# EAGLE design bot_base (EAGLE 7.7.0)
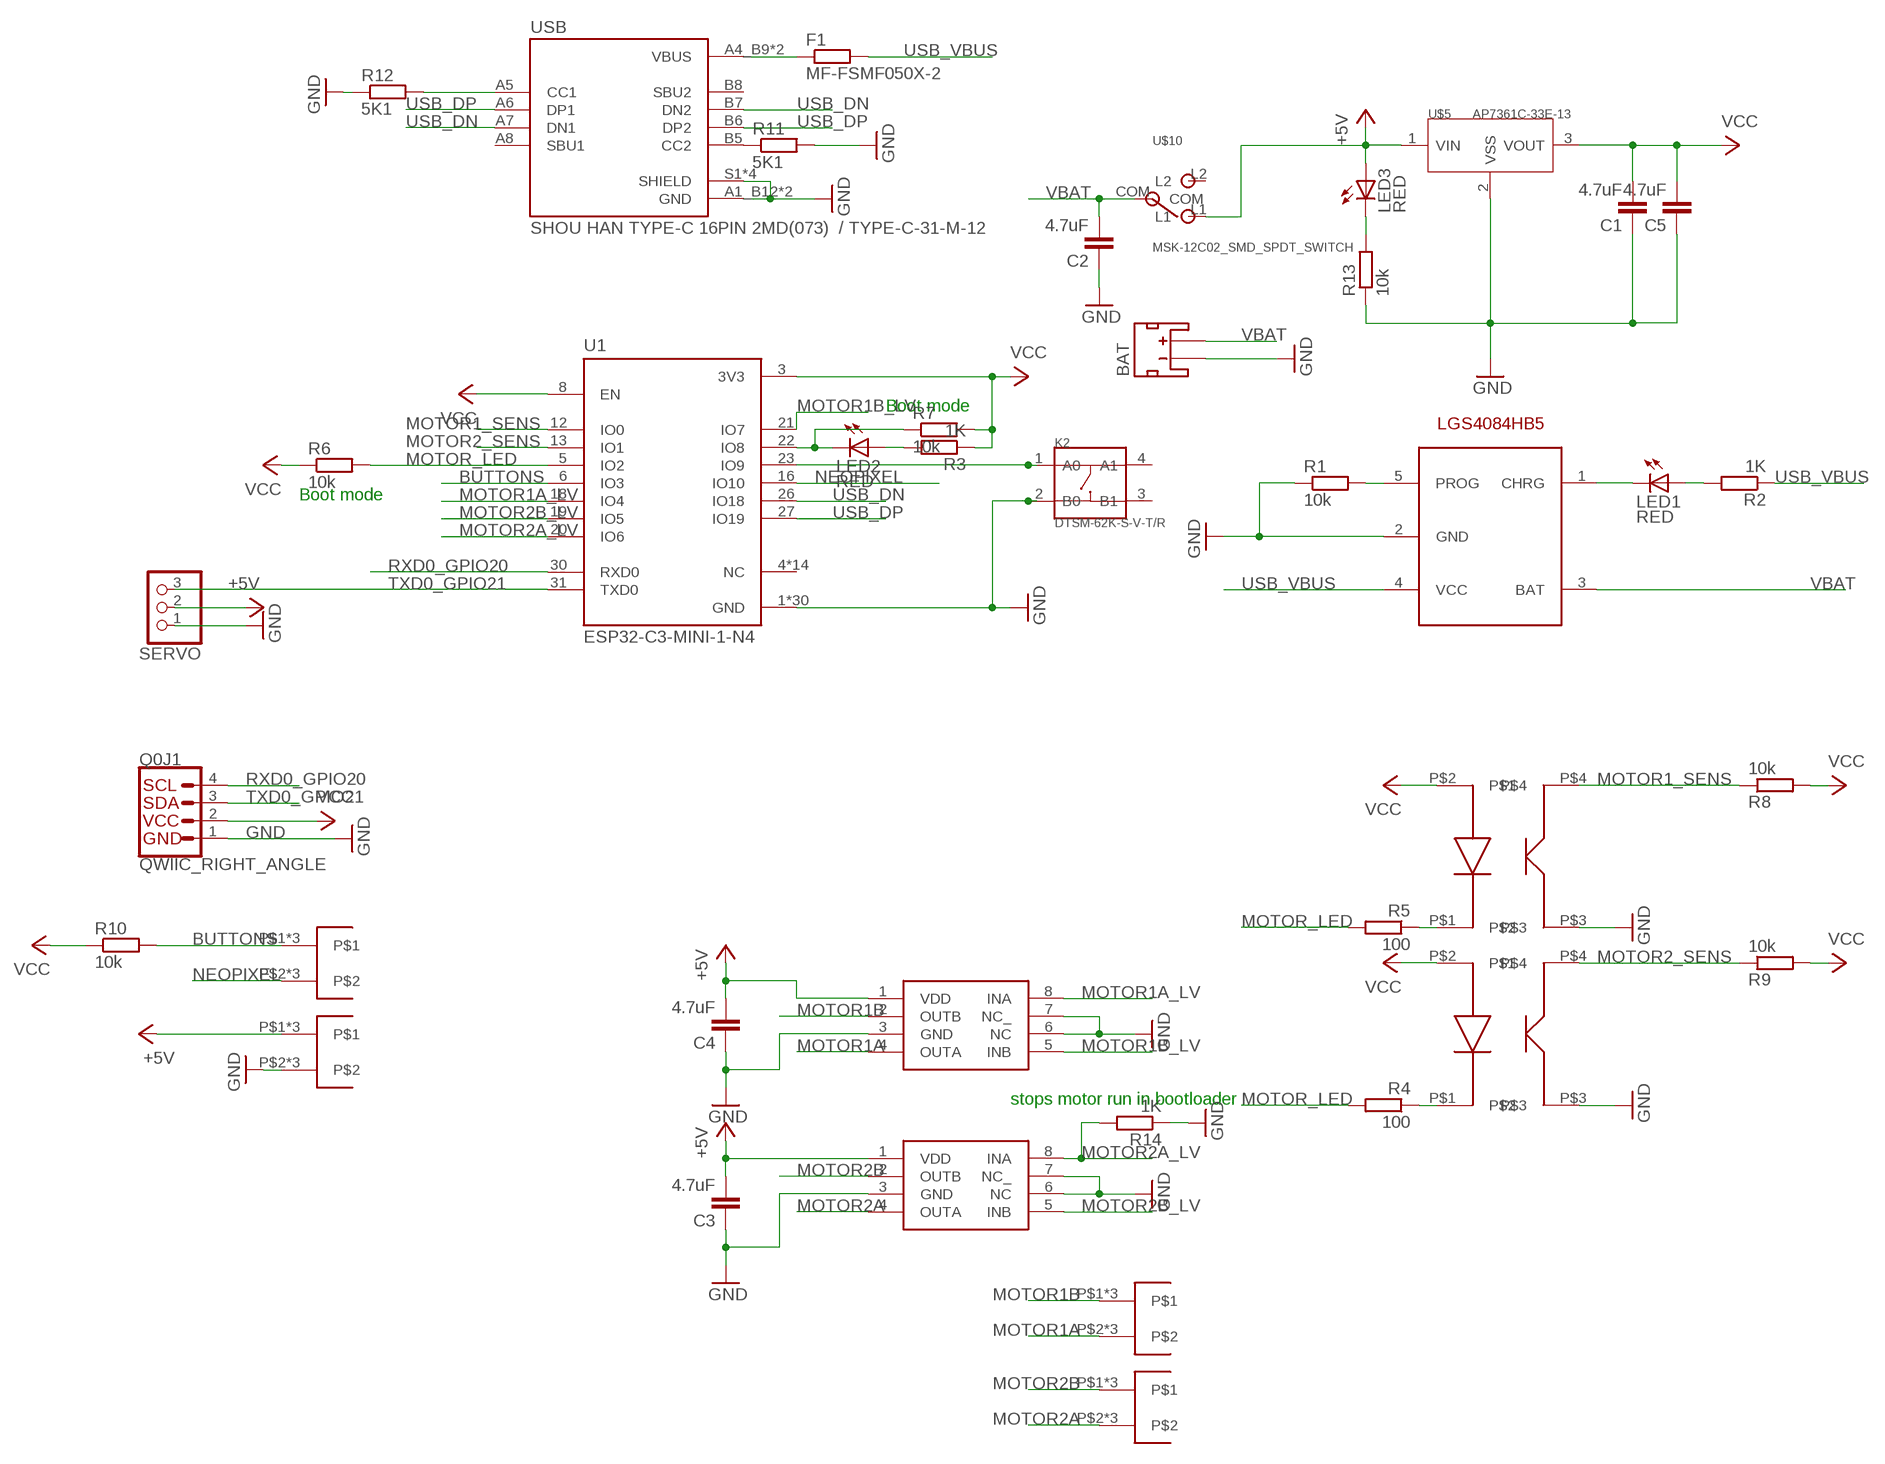
[diagram p0: schematic, sheet 1]

## Parts
BAT  C47647 / S2B-PH-SM4-TB  JST_2MM_MALE  [JST-2-SMD]
C1  4.7uF  C-EUC0805  [C0805]
C2  4.7uF  C-EUC0805  [C0805]
C3  4.7uF  C-EUC0805  [C0805]
C4  4.7uF  C-EUC0805  [C0805]
C5  4.7uF  C-EUC0805  [C0805]
F1  MF-FSMF050X-2  R-EU_R0603  [R0603]
K2  DTSM-62K-S-V-T/R  SMD-SWITCH-TACTILE-SPST-NO(4P-D6.0MM)  [SW4-SMD-6.0X6.0X5.0MM]
LED1  RED  LEDCHIPLED_0603  [CHIPLED_0603]
LED2  RED  LEDCHIPLED_0603  [CHIPLED_0603]
LED3  RED  LEDCHIPLED_0603  [CHIPLED_0603]
Q0  QWIIC_RIGHT_ANGLE  QWIIC_CONNECTORJS-1MM  [JST04_1MM_RA]
R1  10k  R-EU_R0603  [R0603]
R2  1K  R-EU_R0603  [R0603]
R3  1K  R-EU_R0603  [R0603]
R4  100  R-EU_R0603  [R0603]
R5  100  R-EU_R0603  [R0603]
R6  10k  R-EU_R0603  [R0603]
R7  10k  R-EU_R0603  [R0603]
R8  10k  R-EU_R0603  [R0603]
R9  10k  R-EU_R0603  [R0603]
R10  10k  R-EU_R0603  [R0603]
R11  5K1  R-EU_R0603  [R0603]
R12  5K1  R-EU_R0603  [R0603]
R13  10k  R-EU_R0603  [R0603]
R14  1K  R-EU_R0603  [R0603]
SERVO  PINHD-1X03_2.54-S  [1X03-S]
U1  ESP32-C3-MINI-1-N4  [XCVR_ESP32-C3-MINI-1-N4]
U4  LGS4084HB5  [SOT23-5]
U$1  XL-ITR9707  [XL-ITR9707]
U$2  XL-ITR9707  [XL-ITR9707]
U$3  GR6205  [SOP8]
U$4  GR6205  [SOP8]
U$5  AP7361C-33E-13  [SOT223]
U$6  PCBSIDE2  [PCBSIDE2]
U$7  PCBSIDE2  [PCBSIDE2]
U$8  PCBSIDE2  [PCBSIDE2]
U$9  PCBSIDE2  [PCBSIDE2]
U$10  MSK-12C02_SMD_SPDT_SWITCH  [MSK-12C02]
USB  SHOU HAN TYPE-C 16PIN 2MD(073) / TYPE-C-31-M-12  TYPE-C-31-M-12  [HRO_TYPE-C-31-M-12]

## Nets
+5V: C3.2 C4.2 LED3.A SERVO.2 U$3.1(VDD) U$4.1(VDD) U$5.1(VIN) U$9.P$1 U$9.P$3 U$9.P$4 U$10.L1
BOOT: K2.1(A0) U1.23(IO9)
BUTTONS: R10.2 U1.6(IO3) U$8.P$1 U$8.P$3 U$8.P$4
GND: BAT.1(-) C1.1 C2.1 C3.1 C4.1 C5.1 K2.2(B0) Q0.1 R1.1 R11.2 R12.1 R13.1 R14.1 SERVO.1 U1.1(GND) U1.2(GND) U1.11(GND) U1.14(GND) U1.36(GND) U1.37(GND) U1.38(GND) U1.39(GND) U1.40(GND) U1.41(GND) U1.42(GND) U1.43(GND) U1.44(GND) U1.45(GND) U1.46(GND) U1.47(GND) U1.48(GND) U1.49_1(GND) U1.49_2(GND) U1.49_3(GND) U1.49_4(GND) U1.49_5(GND) U1.49_6(GND) U1.49_7(GND) U1.49_8(GND) U1.49_9(GND) U1.50(GND) U1.51(GND) U1.52(GND) U1.53(GND) U4.2(GND) U$1.P$3 U$2.P$3 U$3.3(GND) U$3.6(NC) U$3.7(NC_) U$4.3(GND) U$4.6(NC) U$4.7(NC_) U$5.2(VSS) U$9.P$2 U$9.P$5 U$9.P$6 USB.A1_B12(GND) USB.B1_A12(GND) USB.S1(SHIELD) USB.S2(SHIELD) USB.S3(SHIELD) USB.S4(SHIELD)
MOTOR1_SENS: R8.1 U1.12(IO0) U$1.P$4
MOTOR1A: U$3.4(OUTA) U$6.P$2 U$6.P$5 U$6.P$6
MOTOR1A_LV: U1.18(IO4) U$3.8(INA)
MOTOR1B: U$3.2(OUTB) U$6.P$1 U$6.P$3 U$6.P$4
MOTOR1B_LV: U1.21(IO7) U$3.5(INB)
MOTOR2_SENS: R9.1 U1.13(IO1) U$2.P$4
MOTOR2A: U$4.4(OUTA) U$7.P$2 U$7.P$5 U$7.P$6
MOTOR2A_LV: R14.2 U1.20(IO6) U$4.8(INA)
MOTOR2B: U$4.2(OUTB) U$7.P$1 U$7.P$3 U$7.P$4
MOTOR2B_LV: U1.19(IO5) U$4.5(INB)
MOTOR_LED: R4.2 R5.2 R6.2 U1.5(IO2)
N$1: LED1.C U4.1(CHRG)
N$2: LED3.C R13.2
N$3: R5.1 U$1.P$1
N$4: LED1.A R2.2
N$5: R4.1 U$2.P$1
N$8: LED2.A R3.2
N$9: R11.1 USB.B5(CC2)
N$10: LED2.C R7.1 U1.22(IO8)
N$14: R12.2 USB.A5(CC1)
N$18: R1.2 U4.5(PROG)
NEOPIXEL: U1.16(IO10) U$8.P$2 U$8.P$5 U$8.P$6
RXD0_GPIO20: Q0.4 U1.30(RXD0)
TXD0_GPIO21: Q0.3 SERVO.3 U1.31(TXD0)
USB_DN: U1.26(IO18) USB.A7(DN1) USB.B7(DN2)
USB_DP: U1.27(IO19) USB.A6(DP1) USB.B6(DP2)
USB_VBUS: F1.2 R2.1 U4.4(VCC)
VBAT: BAT.2(+) C2.2 U4.3(BAT) U$10.COM
VBUS1: F1.1 USB.A4_B9(VBUS) USB.B4_A9(VBUS)
VCC: C1.2 C5.2 Q0.2 R3.1 R6.1 R7.2 R8.2 R9.2 R10.1 U1.3(3V3) U1.8(EN) U$1.P$2 U$2.P$2 U$5.3(VOUT)
Unconnected: BAT.NC1(PAD1) BAT.NC2(PAD2) K2.3(B1) K2.4(A1) Q0.NC1 Q0.NC2 U1.4(NC) U1.7(NC) U1.9(NC) U1.10(NC) U1.15(NC) U1.17(NC) U1.24(NC) U1.25(NC) U1.28(NC) U1.29(NC) U1.32(NC) U1.33(NC) U1.34(NC) U1.35(NC) U$10.L2 USB.A8(SBU1) USB.B8(SBU2)

## Notes on the sheet
- Boot mode
- LGS4084HB5
- Boot mode
- stops motor run in bootloader

## Library data of the parts
BAT = SparkFun-Connectors:JST_2MM_MALE: Mates to single-cell LiPo batteries. CONN-11443 Now with smashable polarity marks!; BTM_NEG: -; BTM_POS: +; PROD_ID: CONN-11443; TOP_NEG: -; TOP_POS: +
C1-C5 = rcl:C-EU: CAPACITOR, European symbol
F1 R1-R14 = rcl:R-EU_: RESISTOR, European symbol
K2 = Seeed-OPL-Button:SMD-SWITCH-TACTILE-SPST-NO(4P-D6.0MM): 311020004; MPN: DTSM-62K-S-V-T/R
LED1-LED3 = led:LED: LED OSRAM: - CHIPLED LG R971, LG N971, LY N971, LG Q971, LY Q971, LO R971, LY R971 LH N974, LH R974 LS Q976, LO Q976, LY Q976 LO Q996 - Hyper CHIPLED LW Q18S LB Q993, LB Q99A, LB R99A - SideLED LS A670, LO A670, LY A670, LG A670, LP A670 LB A673, LV A673, LT A673, LW A673 LH A674 LY A675 LS A676, LA A676, LO A676, LY A676, LW A676 LS A679, LY A679, LG A679 - Hyper Micro SIDELED® LS Y876, LA Y876, LO Y876, LY Y876 LT Y87S - SmartLED LW L88C, LW L88S LB L89C, LB L89S, LG L890 LS L89K, LO L89K, LY L89K LS L896, LA L896, LO L896, LY L896 - TOPLED LS T670, LO T670, LY T670, LG T670, LP T670 LSG T670, LSP T670, LSY T670, LOP T670, LYG T670 LG T671, LOG T671, LSG T671 LB T673, LV T673, LT T673, LW T673 LH T674 LS T676, LA T676, LO T676, LY T676, LB T676, LH T676, LSB T676, LW T676 LB T67C, LV T67C, LT T67C, LS T67K, LO T67K, LY T67K, LW E67C LS E67B, LA E67B, LO E67B, LY E67B, LB E67C, LV E67C, LT E67C LW T67C LS T679, LY T679, LG T679 LS T770, LO T770, LY T770, LG T770, LP T770 LB T773, LV T773, LT T773, LW T773 LH T774 LS E675, LA E675, LY E675, LS T675 LS T776, LA T776, LO T776, LY T776, LB T776 LHGB T686 LT T68C, LB T68C - Hyper Mini TOPLED® LB M676 - Mini TOPLED Santana® LG M470 LS M47K, LO M47K, LY M47K Source: http://www.osram.convergy.de LUXEON: - LUMILED® LXK2-PW12-R00, LXK2-PW12-S00, LXK2-PW14-U00, LXK2-PW14-V00 LXK2-PM12-R00, LXK2-PM12-S00, LXK2-PM14-U00 LXK2-PE12-Q00, LXK2-PE12-R00, LXK2-PE12-S00, LXK2-PE14-T00, LXK2-PE14-U00 LXK2-PB12-K00, LXK2-PB12-L00, LXK2-PB12-M00, LXK2-PB14-N00, LXK2-PB14-P00, LXK2-PB14-Q00 LXK2-PR12-L00, LXK2-PR12-M00, LXK2-PR14-Q00, LXK2-PR14-R00 LXK2-PD12-Q00, LXK2-PD12-R00, LXK2-PD12-S00 LXK2-PH12-R00, LXK2-PH12-S00 LXK2-PL12-P00, LXK2-PL12-Q00, LXK2-PL12-R00 Source: www.luxeon.com KINGBRIGHT: KA-3528ASYC Source: www.kingbright.com
Q0 = SparkFun-Connectors:QWIIC_CONNECTOR: SparkFun I2C Standard Qwiic Connector An SMD 1mm pitch JST connector makes it easy and quick (get it? Qwiic?) to connect I2C devices to each other. The Qwiic system <http://www.sparkfun.com/qwiic> enables fast and solderless connection between popular platforms and various sensors and actuators. We carry 200mm <https://www.sparkfun.com/products/14204>, 100mm <https://www.sparkfun.com/products/14205>, 50mm <https://www.sparkfun.com/products/14206>, and breadboard friendly <https://www.sparkfun.com/products/14207> Qwiic cables. We also offer 10 pcs strips <https://www.sparkfun.com/products/14323> the SMD connectors.; PROD_ID: CONN-13694
SERVO = pinhead-2:PINHD-1X03: PIN HEADER
U1 = ESP32-C3-MINI-1-N4:ESP32-C3-MINI-1-N4: Check availability; AVAILABILITY: In Stock; CHECK_PRICES: https://www.snapeda.com/parts/ESP32-C3-MINI-1-N4/Espressif+Systems/view-part/?ref=eda; DESCRIPTION: Bluetooth, WiFi 802.11b/g/n, Bluetooth v5.0 Transceiver Module 2.412GHz ~ 2.484GHz PCB Trace Surface Mount; MF: Espressif Systems; MP: ESP32-C3-MINI-1-N4; PACKAGE: SMD-53 Espressif Systems; PRICE: None; PURCHASE-URL: https://www.snapeda.com/api/url_track_click_mouser/?unipart_id=5656579&manufacturer=Espressif Systems&part_name=ESP32-C3-MINI-1-N4&search_term=None; SNAPEDA_LINK: https://www.snapeda.com/parts/ESP32-C3-MINI-1-N4/Espressif+Systems/view-part/?ref=snap
U4 = lipo_chargers:LGS4084HB5
U$1 U$2 = ir-XINGLIGHT-XL-ITR9608:XL-ITR9707
U$3 U$4 = motordriver-GR6205:GR6205
U$5 = vreg:AP7361C-33E-13
U$6-U$9 = testpoint:PCBSIDE2
U$10 = switch-MSK-12C02:MSK-12C02_SMD_SPDT_SWITCH: Footprint of the VIMEX MSK-12C02 SPDT SMD Switch Created by mzst on 17-Jan-2016
USB = USB-TYPE-C-31-M-12:TYPE-C-31-M-12: Check availability; AVAILABILITY: Not in stock; CHECK_PRICES: https://www.snapeda.com/parts/TYPE-C-31-M-12/HRO+Electronics+Co.%252C+Ltd./view-part/?ref=eda; DESCRIPTION: USB Connectors 24 Receptacle 1 8.94*7.3mm RoHS; MF: HRO Electronics Co., Ltd.; MP: TYPE-C-31-M-12; PACKAGE: Package; PRICE: None; SNAPEDA_LINK: https://www.snapeda.com/parts/TYPE-C-31-M-12/HRO+Electronics+Co.%252C+Ltd./view-part/?ref=snap

## Board
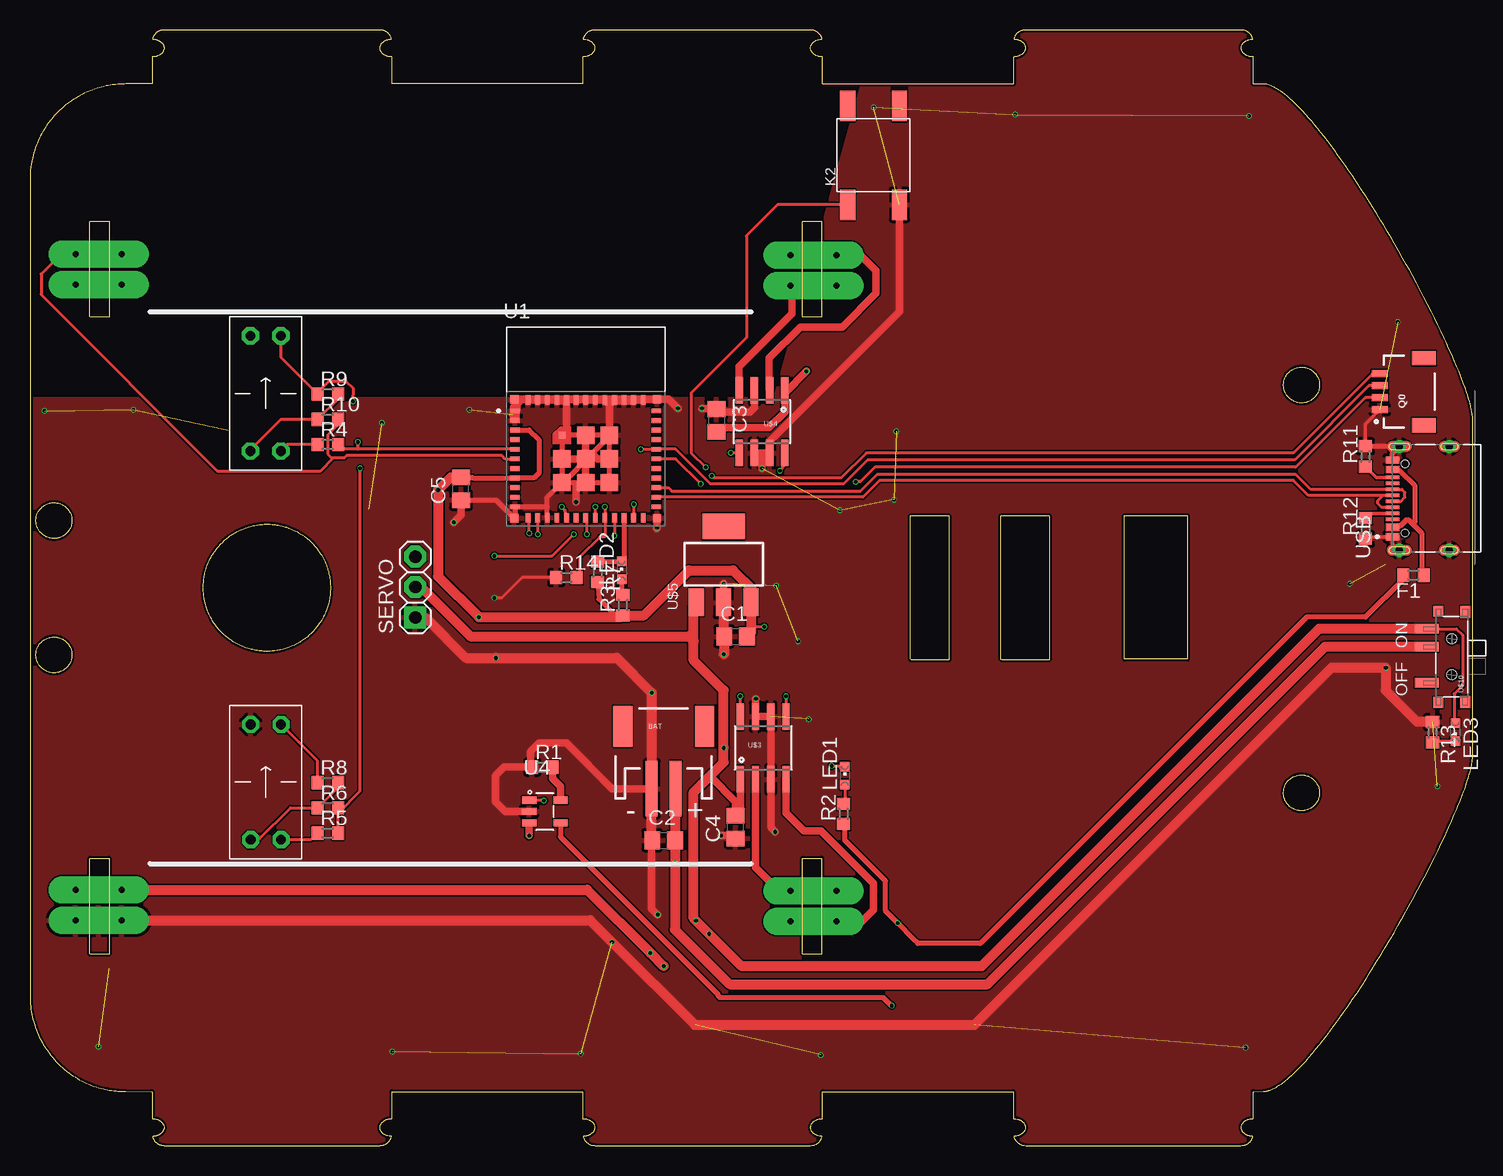
[diagram p1: board, top side]
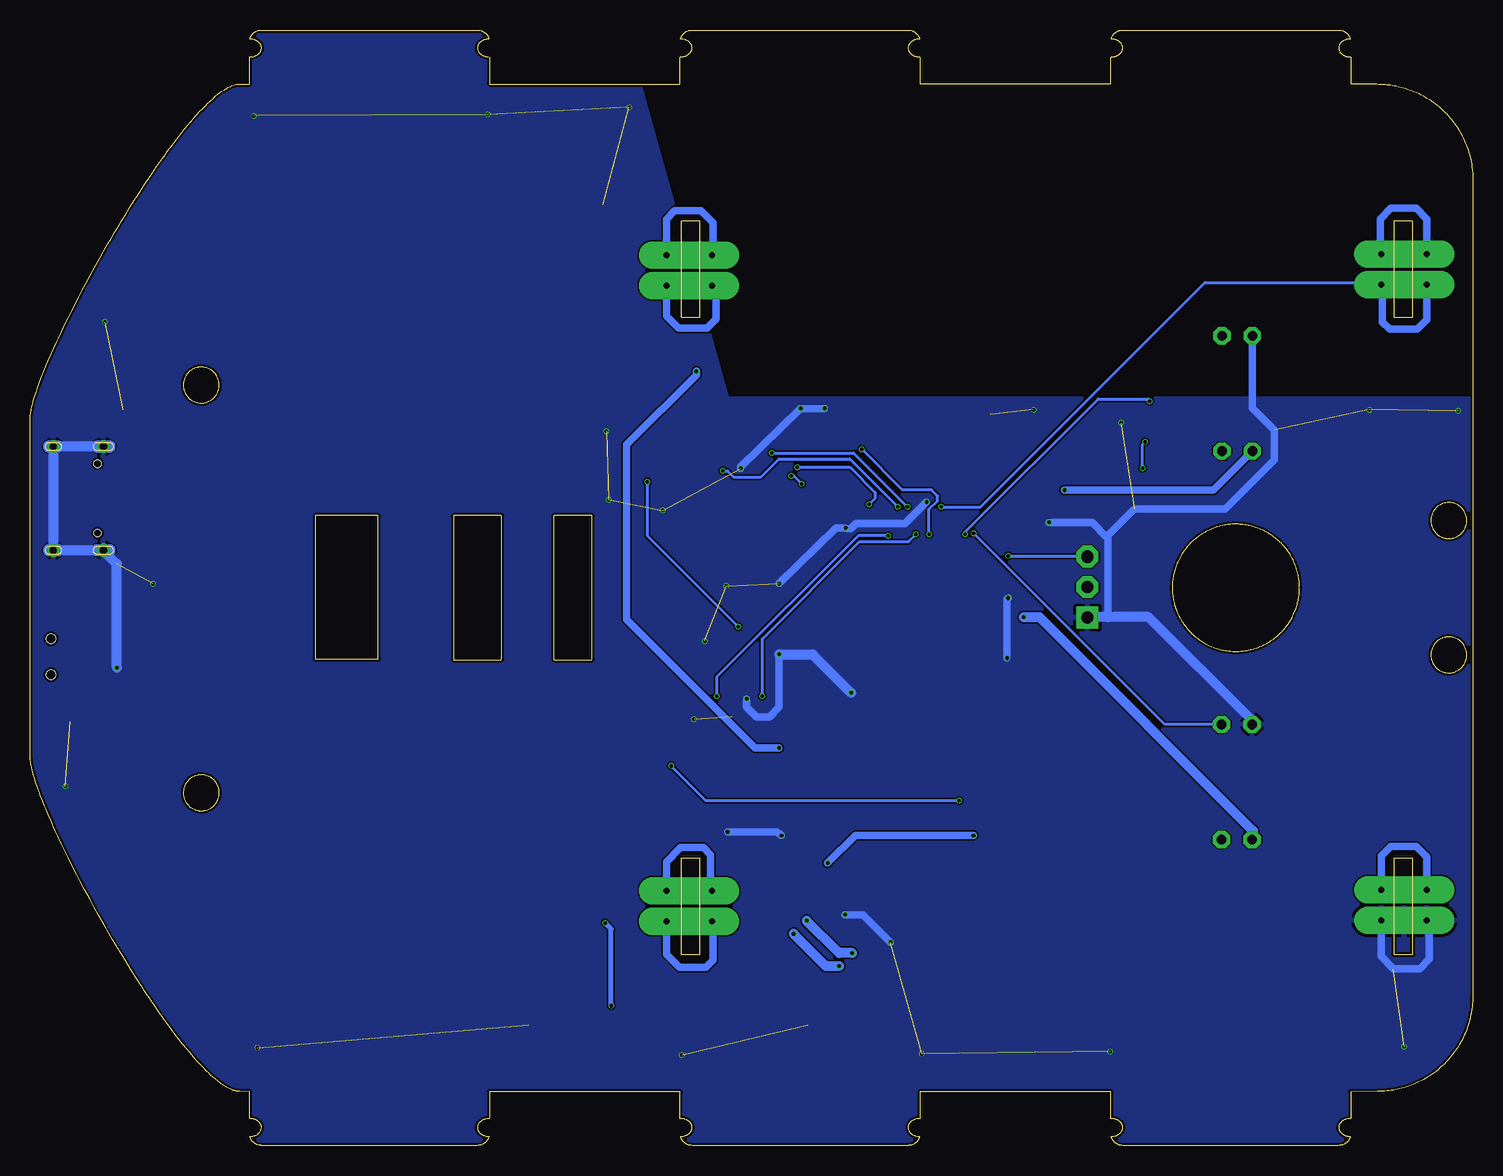
[diagram p2: board, bottom side, seen from below]

Size 120.27 x 93 mm. Coordinates in mm from the lower left corner, seen from the top.
Outline: 1944 segments
Copper layers (1*16): Top 0.035mm / dielectric 1.6mm / Bottom 0.035mm
Design rules "jlcpcb-2layers *": minimum track width 5mil, minimum drill 0.3mm, track to track 5mil, track to pad 5mil, pad to pad 5mil, via to via 5mil, smd to smd 5mil, copper to edge 0.2mm, drill to drill 6mil, minimum pad ring 10mil, minimum via ring 3mil, stop-mask expansion 4mil, vias tented up to drill 25mil, thermal gap 10mil
tKeepout: area 6.6,4.4 to 64.3,23.4; area 6.6,69.5 to 64.3,88.5; area 73.4,4.9 to 106.1,88.5

### Footprints (pad centres in the part's own frame; a part is rotated, then mirrored left to right if it is on the bottom)
JST-2-SMD = smd 1 x 4.6: 1 -1,-3.7; 2 1,-3.7 | smd 1.6 x 3.4: NC1 -3.4,1.5; NC2 3.4,1.5
C0805 = smd 1.3 x 1.5: 1 -0.95,0; 2 0.95,0
R0603 = smd 1 x 1.1: 1 -0.85,0; 2 0.85,0
SW4-SMD-6.0X6.0X5.0MM = smd 2.54 x 1.27: 1 -4.129,2.159; 2 -4.129,-2.159; 3 4.129,-2.159; 4 4.129,2.159
CHIPLED_0603 = smd 0.8 x 0.8: A 0,-0.75; C 0,0.75
JST04_1MM_RA = smd 0.6 x 1.35: 1 -1.5,0; 2 -0.5,0; 3 0.5,0; 4 1.5,0 | smd 1.2 x 2: NC1 2.8,-3.675; NC2 -2.8,-3.675
1X03-S = drill 1.016 square: 1 -2.54,0 | drill 1.016 octagon: 2 0,0; 3 2.54,0
XCVR_ESP32-C3-MINI-1-N4 = smd 0.8 x 0.4: 1 -5.9,1.3; 2 -5.9,0.5; 3 -5.9,-0.3; 4 -5.9,-1.1; 5 -5.9,-1.9; 6 -5.9,-2.7; 7 -5.9,-3.5; 8 -5.9,-4.3; 9 -5.9,-5.1; 10 -5.9,-5.9; 11 -5.9,-6.7; 25 5.9,-6.7; 26 5.9,-5.9; 27 5.9,-5.1; 28 5.9,-4.3; 29 5.9,-3.5; 30 5.9,-2.7; 31 5.9,-1.9; 32 5.9,-1.1; 33 5.9,-0.3; 34 5.9,0.5; 35 5.9,1.3 | smd 0.4 x 0.8: 12 -4.8,-7.6; 13 -4,-7.6; 14 -3.2,-7.6; 15 -2.4,-7.6; 16 -1.6,-7.6; 17 -0.8,-7.6; 18 0,-7.6; 19 0.8,-7.6; 20 1.6,-7.6; 21 2.4,-7.6; 22 3.2,-7.6; 23 4,-7.6; 24 4.8,-7.6; 36 4.8,2.2; 37 4,2.2; 38 3.2,2.2; 39 2.4,2.2; 40 1.6,2.2; 41 0.8,2.2; 42 0,2.2; 43 -0.8,2.2; 44 -1.6,2.2; 45 -2.4,2.2; 46 -3.2,2.2; 47 -4,2.2; 48 -4.8,2.2 | smd 0.6 x 0.6: 49_1 -1.975,-0.725 | smd 1.45 x 1.45: 49_2 0,-0.725; 49_3 1.975,-0.725; 49_4 1.975,-2.7; 49_5 1.975,-4.675; 49_6 0,-4.675; 49_7 -1.975,-4.675; 49_8 -1.975,-2.7; 49_9 0,-2.7 | smd 0.7 x 0.7: 50 5.95,2.25; 51 5.95,-7.65; 52 -5.95,-7.65; 53 -5.95,2.25
SOT23-5 = smd 1.2 x 0.6: 1 -1.306,0.95; 2 -1.306,0; 3 -1.306,-0.95; 4 1.306,-0.95; 5 1.306,0.95
XL-ITR9707 = drill 0.8 octagon: P$1 -4.8,-1.27; P$2 -4.8,1.27; P$3 4.8,1.27; P$4 4.8,-1.27
SOP8 = smd 0.61 x 2.21: 1 -1.905,-2.616; 2 -0.635,-2.616; 3 0.635,-2.616; 4 1.905,-2.616; 5 1.905,2.616; 6 0.635,2.616; 7 -0.635,2.616; 8 -1.905,2.616
SOT223 = smd 1.27 x 2.286: 1 -2.286,-3.175; 2 0,-3.175; 3 2.286,-3.175 | smd 3.556 x 2.159: TER 0,3.175
PCBSIDE2 = drill 0 pad 2.286 long: P$1 0,1.27; P$2 0,-1.27 | drill 0.5 pad 2.286 long: P$3 -1.905,1.27; P$4 1.905,1.27; P$5 -1.905,-1.27; P$6 1.905,-1.27
MSK-12C02 = smd 0.8 x 2: COM 0.823,2.1; L1 2.323,2.1; L2 -2.177,2.1 | smd 1 x 0.8: GND@1 -3.75,-1.125; GND@4 3.75,-1.125 | smd 0.9 x 0.8: GND@2 -3.8,1.125; GND@3 3.8,1.125 | hole 0.8: -1.5,0; 1.5,0
HRO_TYPE-C-31-M-12 = smd 0.6 x 1.14: A1_B12 -3.2,4.75; A4_B9 -2.4,4.75; B1_A12 3.2,4.75; B4_A9 2.4,4.75 | smd 0.3 x 1.14: A5 -1.25,4.75; A6 -0.25,4.75; A7 0.25,4.75; A8 1.25,4.75; B5 1.75,4.75; B6 0.75,4.75; B7 -0.75,4.75; B8 -1.75,4.75 | drill 0.6 pad 0.9: S1 -4.325,4.17; S2 4.325,4.17; S3 -4.325,0; S4 4.325,0 | hole 0.6: -2.89,3.68; 2.89,3.68

### Placement (x,y rotation side)
BAT  52.82,33.45 0 top
C1  58.82,42.45 0 top
C2  52.82,25.45 0 top
C3  57.22,60.45 270 top
C4  58.82,26.55 90 top
C5  35.92,54.75 90 top
F1  115.32,47.55 180 top
K2  70.32,82.55 90 top
LED1  67.92,30.85 0 top
LED2  49.32,47.95 0 top
LED3  118.82,34.45 180 top
Q0  112.52,62.85 90 top
R1  42.72,31.55 0 top
R2  67.82,27.65 90 top
R3  49.42,45.05 90 top
R4  24.82,58.45 0 top
R5  24.82,26.05 0 top
R6  24.82,28.15 0 top
R7  47.32,47.85 270 top
R8  24.82,30.25 0 top
R9  24.82,62.65 0 top
R10  24.82,60.55 0 top
R11  111.32,57.45 90 top
R12  111.32,51.45 90 top
R13  116.92,34.45 270 top
R14  44.72,47.35 0 top
SERVO  32.12,46.55 90 top
U1  46.32,59.95 0 top
U4  42.92,27.85 0 top
U$1  19.66,30.31 90 top
U$2  19.64,62.7 90 top
U$3  61.12,33.15 0 top
U$4  61.02,60.35 180 top
U$5  57.82,48.45 0 top
U$6  65.32,19.95 0 top
U$7  65.32,72.95 0 top
U$8  5.72,73.05 0 top
U$9  5.72,20.05 0 top
U$10  118.52,40.75 90 top
USB  118.32,53.95 90 top

### Tracks (layer width: path | path; a pad name or v marks a point on that pad's centre or on a via)
+5V  (via drill 0.3)
  Top 0.254: U$10.L1 118.9,43.07 119.42,42.55 119.42,38.35 118.72,37.65 118.72,35.3 LED3.A
  Top 0.61: U$4.1 62.93,61.15 62.92,61.15 | 57.92,59.85 57.57,59.85 C3.2 57.57,59.5 57.92,59.85 | U$3.1 59.22,27.89 C4.2 58.82,28.65 56.67,30.8 | 57.92,59.85 61.62,59.85 62.92,61.15 | 62.92,61.15 62.92,62.75 v64.72,64.55
  Top 0.813: U$10.L1 107.44,43.07 79.32,14.95 59.32,14.95 v55.52,18.75 55.32,18.95 55.32,29.45 56.67,30.8 57.82,31.95 v57.82,33.15 57.82,37.95 55.32,40.45 55.32,42.05 | 55.32,42.05 55.32,45.06 U$5.1 | U$9.P$4 46.45,21.32 v51.72,16.05 v52.82,14.95 | SERVO.2 32.62,46.55 36.72,42.45 54.92,42.45 55.32,42.05
  Bottom 0.61: U$9.P$3 3.82,24.04 4.72,24.95 6.82,24.95 7.62,24.15 7.62,21.35 | 7.62,21.35 U$9.P$4 | U$9.P$4 7.63,21.34 7.62,21.35 | U$9.P$1 U$9.P$4 | v64.72,64.55 64.72,64.25 70.52,58.45 70.52,43.85 59.82,33.15 v57.82,33.15
  Bottom 0.813: v51.72,16.05 52.82,16.05 v55.52,18.75 | v56.62,17.65 53.92,14.95 v52.82,14.95
BOOT  (via drill 0.3)
  Top 0.254: K2.1 62.29,78.42 59.72,75.85 59.72,67.35 55.12,62.75 55.12,57.75 v56.32,56.55 | v50.32,53.45 U1.23
  Bottom 0.254: v56.32,56.55 51.92,56.55 49.82,54.45 49.82,53.95 v50.32,53.45
BUTTONS
  Top 0.254: R10.2 25.67,60.1 24.82,59.25 24.82,57.65 25.12,57.35 25.32,57.35 | 25.32,57.35 26.22,57.35 26.42,57.55 39.32,57.55 39.62,57.25 U1.6 | U$8.P$1 2.59,74.32 0.92,72.65 0.92,70.95 15.62,56.25 24.22,56.25 25.32,57.35
  Bottom 0.61: U$8.P$4 7.72,74.41 7.72,77.25 6.82,78.15 4.72,78.15 3.82,77.24 U$8.P$3 U$8.P$1
GND  (via drill 0.3)  (21 unrouted)
  Top 0.254: R14.1 41.02,47.35 39.32,45.65 v38.72,45.65
  Top 0.305: R12.1 111.47,50.75 USB.A1_B12 113.57,50.2 USB.S1 | Q0.1 111.32,60.15 R11.2
  Top 0.406: USB.B1_A12 113.57,57.69 USB.S2 114.13,58.3 R11.2 | U1.50 50.12,62.2 49.52,62.2 45.82,62.2 U1.53 40.37,60.5 U1.2 | U1.14 43.12,53.25 | 43.12,53.25 U1.11 40.42,52.35 U1.52 38.87,53.8 C5.1 | 43.12,53.25 43.12,54.05 44.32,55.25 | U1.49_7 45.82,55.27 U1.49_6 U1.49_5 U1.49_4 U1.49_3 U1.49_2 44.92,59.22 U1.49_1 U1.49_8 U1.49_7 | U1.49_7 44.32,55.25 | 44.32,55.25 44.42,55.25 46.87,57.7 48.32,59.15 48.32,59.25
  Top 0.61: U$4.3 60.39,61.51 60.02,61.15 57.47,61.15 C3.1 57.17,61.45 v56.02,61.45 | v61.02,56.45 61.02,57.75 61,57.73 U$4.6 U$4.7 61.62,57.77 61.62,58.65 72.48,69.51 K2.2 | U1.51 v52.27,51.5 52.22,51.45 | v45.52,53.65 45.52,54.97 45.82,55.27 | v57.82,46.85 U$5.2 | v62.12,26.15 61.76,26.51 U$3.3 U$3.6 U$3.7 60.49,37.21 v60.52,37.25 | v57.62,25.85 58.57,25.85 C4.1 | 51.82,25.45 51.82,19.75 v52.32,19.25 | BAT.1 48.52,29.75 44.72,33.55 42.42,33.55 41.72,32.85 41.72,31.7 R1.1 39.52,31.55 38.82,30.85 38.82,28.65 39.62,27.85 U4.2 | C5.1 35.92,52.55 v35.32,51.95 | U1.49_8 U1.49_9 | U1.49_2 U1.49_9 | U1.49_4 47.32,57.25 46.87,57.7 | 48.32,59.25 48.32,61.75 | 48.32,61.75 U1.40 | 44.92,59.22 44.72,59.42 U1.44 44.62,62.05 44.02,62.05 U1.45 U1.46 U1.47 U1.48 | U1.49_6 U1.49_9 | U1.39 U1.38 49.52,62.2 | 50.12,62.2 50.17,62.15 U1.37 U1.36 | 48.32,61.75 48.62,62.05 50.32,62.05 50.47,62.2 U1.50 40.97,62.2 40.32,61.55 40.32,61.05 40.22,60.95 40.32,60.95 40.32,60.75 40.52,60.55 40.52,61.25 40.62,61.35 40.62,62.15 40.52,62.25 53.22,62.25 v54.02,61.45 | U1.40 48.02,62.15 | U1.40 U1.41 U1.42 | U1.43 45.77,62.15 45.82,62.2 | U1.1 40.42,62.15 U1.53
  Top 0.813: C2.1 51.82,25.45 BAT.1 v51.82,37.75 48.92,40.65 v38.82,40.65 36.32,40.65 32.96,44.01 SERVO.1 | U$9.P$6 46.69,18.78 v48.52,16.95 55.42,10.05 78.72,10.05 108.52,39.85 v113.02,39.85 113.02,37.95 115.62,35.35 116.87,35.35 R13.1 | U$5.2 57.82,42.5 C1.1 57.87,41 v57.82,40.95
  Bottom 0.61: v61.02,56.45 61.02,56.55 v56.02,61.45 v54.02,61.45 | 52.22,51.45 51.82,51.45 51.42,51.85 47.32,51.85 v45.52,53.65 | v52.27,51.5 53.07,51.5 v57.82,46.85 | v62.12,26.15 58.02,26.15 v57.62,25.85 | v52.32,19.25 50.82,19.25 v48.52,16.95 | v60.52,37.25 60.52,36.55 59.72,35.75 58.62,35.75 57.82,36.55 v57.82,40.95 | v35.32,51.95 31.72,51.95 30.52,50.75 | 30.52,50.75 30.42,50.65 30.42,44.05 | U$2.P$3 18.37,61.5 16.52,59.65 16.52,57.15 20.62,53.05 28.22,53.05 30.52,50.75 | v38.82,40.65 38.82,45.55 v38.72,45.65 | U$9.P$6 7.63,15.75 6.62,14.75 4.42,14.75 3.62,15.55 3.62,18.58 U$9.P$5 U$9.P$2
  Bottom 0.813: v113.02,39.85 113.02,48.49 USB.S1 USB.S3 118.32,58.25 118.3,58.27 USB.S2 USB.S4 | v57.82,40.95 55.02,40.95 v51.82,37.75 | U$1.P$3 18.39,35.42 27.02,44.05 30.42,44.05 32.08,44.05 SERVO.1
  other vias: 5.72,8.25 30.22,7.85 45.92,7.65 65.92,7.55 101.32,8.15 117.32,29.95 114.02,68.65 101.62,85.85 82.12,85.95 70.32,86.55 1.22,61.25 8.62,61.35 29.32,60.25 36.62,61.35 64.02,42.05 62.22,46.65 67.52,52.95 72.02,53.85 64.92,35.55 72.22,59.55 110.02,46.85
  pour Top: -0.08,62.25 62.22,62.25 62.22,62.45 70.82,93.35 122.72,93.35 122.92,63.55 122.92,0.15 0.12,0.15
  pour Bottom: -0.08,61.85 -0.08,62.25 62.22,62.25 62.22,62.45 70.82,93.35 122.72,93.35 122.92,63.15 122.92,0.15 0.12,0.15
MOTOR1_SENS  (via drill 0.3)
  Top 0.254: R8.1 23.97,32.07 U$1.P$4 | v41.62,51.05 41.62,52.25 U1.12
  Bottom 0.254: U$1.P$4 25.68,35.11 v41.62,51.05
MOTOR1A
  Top 0.61: U$3.4 63.03,27.74 64.52,26.25 65.92,26.25 70.32,21.85 70.32,19.65 69.32,18.65 65.35,18.65 U$6.P$2 U$6.P$6
  Bottom 0.61: U$6.P$6 67.23,15.95 66.12,14.85 63.92,14.85 63.32,15.45 63.32,18.58 U$6.P$5
MOTOR1A_LV  (via drill 0.3)
  Top 0.254: U$3.8 v59.22,37.44 v59.22,37.45 | v46.42,50.95 46.42,52.25 U1.18
  Bottom 0.254: v59.22,37.45 59.22,42.25 51.12,50.35 47.02,50.35 v46.42,50.95
MOTOR1B
  Top 0.61: U$3.2 60.49,23.18 62.52,21.15 63.35,21.15 U$6.P$3 | U$6.P$1 U$6.P$4
  Bottom 0.61: U$6.P$4 67.23,23.64 66.02,24.85 64.12,24.85 63.52,24.25 63.52,21.32 U$6.P$3
MOTOR1B_LV  (via drill 0.3)
  Top 0.254: U1.21 v48.72,50.85 | v63.02,37.45 U$3.5
  Bottom 0.254: v48.72,50.85 51.22,50.85 63.02,39.05 v63.02,37.45
MOTOR2_SENS  (via drill 0.3)
  Top 0.254: U$2.P$4 20.91,65.71 R9.1 | R9.1 23.97,62.5 | R9.1 23.97,62.8 24.92,63.75 26.32,63.75 26.92,63.15 26.92,62.55 v26.92,62.05 | U1.13 v42.32,50.95
  Bottom 0.254: v42.32,50.95 42.32,51.15 31.22,62.25 27.12,62.25 v26.92,62.05
MOTOR2A
  Top 0.61: U$4.4 59.12,64.94 63.52,69.35 63.52,71.57 | 63.52,71.57 U$7.P$5 | 63.52,71.57 65.22,71.57 U$7.P$2
  Bottom 0.61: U$7.P$6 67.23,69.15 66.22,68.15 63.82,68.15 63.07,68.9 63.07,71.33 U$7.P$5
MOTOR2A_LV  (via drill 0.3)
  Top 0.254: U$4.8 62.93,56.75 v62.52,56.25 | v47.92,53.25 U1.20 47.92,50.75 47.52,50.75 45.82,49.05 45.82,47.6 R14.2
  Bottom 0.254: v62.52,56.25 62.12,56.25 61.62,55.75 59.32,55.75 57.82,57.25 51.92,57.25 v47.92,53.25
MOTOR2B
  Top 0.61: U$7.P$3 63.45,74.25 69.22,74.25 70.52,72.95 70.52,71.05 67.72,68.25 64.22,68.25 61.62,65.65 61.62,63 U$4.2 | U$7.P$1 U$7.P$4
  Bottom 0.61: U$7.P$4 67.23,77.24 66.52,77.95 64.32,77.95 63.32,76.95 63.32,74.31 U$7.P$3
MOTOR2B_LV  (via drill 0.3)
  Top 0.254: U$4.5 58.44,57.73 v58.42,57.75 | v47.12,53.25 U1.19
  Bottom 0.254: v58.42,57.75 51.62,57.75 v47.12,53.25
MOTOR_LED  (via drill 0.3)
  Top 0.254: U1.5 27.32,58.05 | 27.32,58.05 26.07,58.05 R4.2 | R6.2 R5.2 25.67,27.7 27.52,29.55 v27.52,56.45 | v27.32,58.65 27.32,58.05
  Bottom 0.254: v27.52,56.45 27.52,58.45 v27.32,58.65
N$1  (via drill 0.3)
  Top 0.254: U4.1 42.77,28.8 v42.82,28.75 | v66.82,31.65 67.87,31.65 LED1.C
  Bottom 0.254: v42.82,28.75 63.92,28.75 v66.82,31.65
N$2
  Top 0.254: LED3.C 117.02,33.7 R13.2
N$3
  Top 0.254: U$1.P$1 23.43,25.51 R5.1
N$4
  Top 0.254: LED1.A 67.92,28.6 R2.2
N$5
  Top 0.254: R4.1 21.46,58.45 U$2.P$1
N$8
  Top 0.406: LED2.A 49.32,46 R3.2
N$9
  Top 0.305: USB.B5 112.22,55.7 R11.1
N$10
  Top 0.406: U1.22 49.52,48.9 LED2.C R7.1
N$14
  Top 0.305: USB.A5 111.72,52.7 R12.2
N$18
  Top 0.61: R1.2 43.57,30.6 44.22,29.95 U4.5
NEOPIXEL  (via drill 0.3)
  Top 0.254: U1.16 44.62,52.95 v44.32,53.25
  Bottom 0.254: v44.32,53.25 41.02,53.25 22.32,71.95 7.8,71.95 U$8.P$6
  Bottom 0.61: U$8.P$5 3.82,68.85 4.62,68.05 6.92,68.05 7.52,68.65 7.52,71.67 | 7.52,71.67 U$8.P$6 | 7.52,71.67 5.83,71.67 U$8.P$2
RXD0_GPIO20  (via drill 0.3)
  Top 0.254: 111.92,64.35 105.32,57.75 69.72,57.75 67.62,55.65 57.02,55.65 v56.82,55.85 | v55.92,55.15 53.82,57.25 U1.30
  Top 0.305: Q0.4 111.92,64.35
  Bottom 0.254: v56.82,55.85 56.62,55.85 v55.92,55.15
TXD0_GPIO21  (via drill 0.3)
  Top 0.254: Q0.3 111.62,63.35 105.42,57.15 69.82,57.15 67.82,55.15 56.72,55.15 53.82,58.05 U1.31 v50.92,58.05 | v38.72,49.15 43.52,49.15 v45.32,50.95
  Bottom 0.254: SERVO.3 38.66,49.09 v38.72,49.15 | v45.32,50.95 45.32,53.05 44.62,53.75 44.62,54.15 45.12,54.65 47.52,54.65 v50.92,58.05
USB_DN
  Top 0.254: USB.B7 112.67,53.2 112.32,53.55 112.32,53.75 112.77,54.2 USB.A7 106.57,54.2 105.32,55.45 70.82,55.45 69.42,54.05 U1.26
USB_DP
  Top 0.254: USB.A6 114.27,53.7 114.62,54.05 114.62,54.45 114.37,54.7 USB.B6 106.77,54.7 105.52,55.95 70.62,55.95 69.22,54.55 53.52,54.55 53.22,54.85 U1.27
USB_VBUS  (via drill 0.3)
  Top 0.406: F1.2 114.47,47.2 111.32,44.05 106.42,44.05 79.22,16.85 74.02,16.85 73.62,17.25 v72.32,18.55 71.32,19.55 71.32,22.05 67.92,25.45 67.92,26.7 R2.1 | U4.4 44.23,25.74 57.32,12.65 57.32,12.55 57.52,12.35 71.12,12.35 v71.82,11.65
  Bottom 0.406: v71.82,11.65 71.82,18.05 v72.32,18.55
VBAT  (via drill 0.3)
  Top 0.61: U4.3 v41.61,25.86 v41.62,25.85
  Top 0.813: BAT.2 53.82,25.45 C2.2 53.77,24.85 v53.77,23.55 53.77,18 58.32,13.45 79.82,13.45 107.94,41.57 U$10.COM
  Bottom 0.61: v41.62,25.85 51.47,25.85 v53.77,23.55
VBUS1
  Top 0.406: USB.B4_A9 114.22,56.25 115.42,55.05 115.42,51.95 115.27,51.8 | USB.A4_B9 114.22,51.65 114.72,52.15 114.92,52.15 115.27,51.8 | 115.27,51.8 116.02,51.05 116.02,47.7 F1.1
VCC  (via drill 0.3)
  Top 0.254: Q0.2 111.32,62.35 105.52,56.55 70.42,56.55 69.22,55.35 v68.82,55.35 | v61.22,43.25 60.31,43.25 60.11,43.45 | U$2.P$2 18.37,58 20.92,60.55 R10.1 25.67,62.25 R9.2 | U$1.P$2 19.08,25.51 21.72,28.15 R6.1 25.67,29.85 R8.2
  Top 0.406: U1.3 41.62,59.65 42.42,58.85 42.42,56.05 42.02,55.65 U1.8 36.92,55.65 36.87,55.7 C5.2 | R7.2 47.42,45.55 48.82,44.15 49.37,44.15 R3.1
  Top 0.813: U$5.3 60.11,44.75 | 60.11,44.75 60.11,43.45 60.11,42.79 C1.2 | 60.11,44.75 60.22,44.86 60.22,46.35 58.62,47.95 54.92,47.95 51.17,44.2 R3.1 49.27,44.05 v37.42,44.05 34.02,47.45 v34.02,54.65 35.07,55.7 C5.2
  Bottom 0.254: v68.82,55.35 68.82,50.85 v61.22,43.25
  Bottom 0.61: v34.02,54.65 21.61,54.65 U$2.P$2
  Bottom 0.813: v37.42,44.05 36.12,44.05 18.32,26.25 18.32,25.58 U$1.P$2

### Text on the board
tPlace: OFF ON